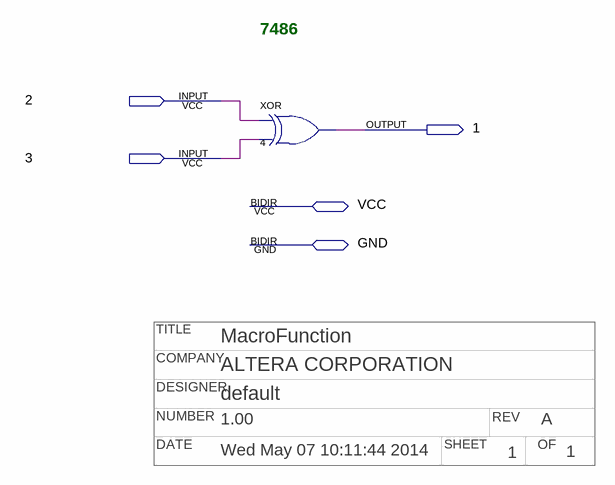
[diagram p0: schematic sheet]
// Quartus schematic np7486.bdf as structural Verilog: 1 symbols, 5 pins
// Title block: TITLE: MacroFunction; COMPANY: ALTERA CORPORATION; DESIGNER: default; NUMBER: 1.00; REV: A; DATE: Wed May 07 10:11:44 2014; SHEET: 1; OF: 1
module np7486 (
  input  \2 ,
  input  \3 ,
  inout  VCC,
  inout  GND,
  output \1 
);

  xor u_4 (\1 , \2 , \3 );

  // Notes on the sheet:
  //   7486
endmodule
